# EAGLE design LB_BIT_i20_SOUNDTRIGGER-v03(rev1) (EAGLE 6.6.0)
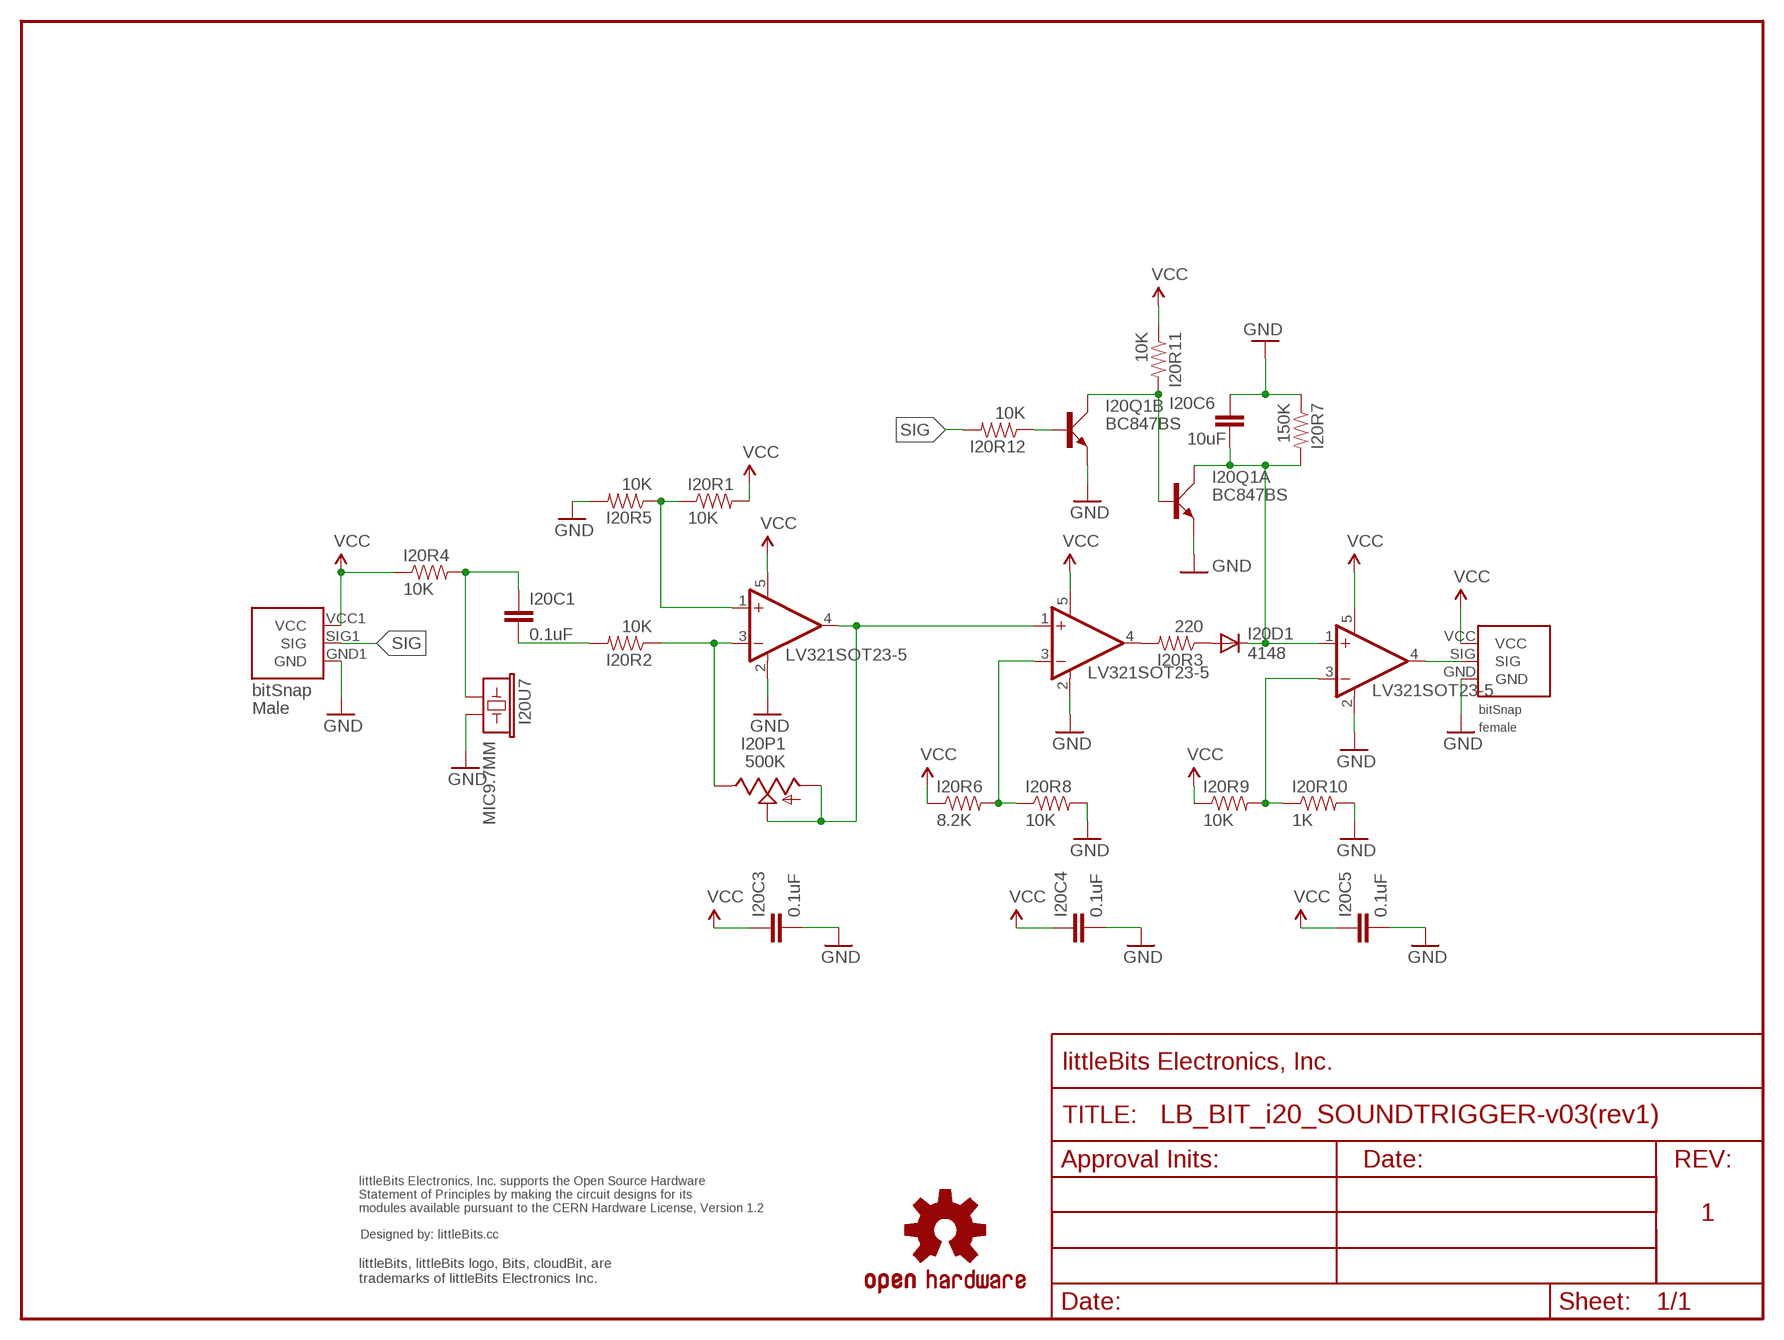
[diagram p0: schematic, sheet 1]

## Parts
I20BSF1  BITSNAP_V03_FEMALE  [BITSNAP_V03_FEMALE]
I20BSM1  BITSNAP_V03_MALE  [BITSNAP_V03_MALE]
I20C1  0.1uF  CAP0603-CAP  [0603-CAP]
I20C3  0.1uF  CAP0603-CAP  [0603-CAP]
I20C4  0.1uF  CAP0603-CAP  [0603-CAP]
I20C5  0.1uF  CAP0603-CAP  [0603-CAP]
I20C6  10uF  CAP0805  [0805]
I20D1  4148  DIODESOD  [SOD-323]
I20P1  500K  POT-TRIM-SMD-BOURNS-3303  [POT-TRIM-SMD-BOURNS-3303]
I20Q1  BC847BS  [SOT363_PHILIPS]
I20R1  10K  RESISTOR0603-RES  [0603-RES]
I20R2  10K  RESISTOR0603-RES  [0603-RES]
I20R3  220  RESISTOR0603-RES  [0603-RES]
I20R4  10K  RESISTOR0603-RES  [0603-RES]
I20R5  10K  RESISTOR0603-RES  [0603-RES]
I20R6  8.2K  RESISTOR0603-RES  [0603-RES]
I20R7  150K  RESISTOR0603-RES  [0603-RES]
I20R8  10K  RESISTOR0603-RES  [0603-RES]
I20R9  10K  RESISTOR0603-RES  [0603-RES]
I20R10  1K  RESISTOR0603-RES  [0603-RES]
I20R11  10K  RESISTOR0603-RES  [0603-RES]
I20R12  10K  RESISTOR0603-RES  [0603-RES]
I20U1  LV321SOT23-5  [SOT23-5]
I20U2  LV321SOT23-5  [SOT23-5]
I20U3  LV321SOT23-5  [SOT23-5]
I20U7  MIC9.7MM  [MIC-9.7MM]
U$1  OSHWCREDIT  [OSHWCREDIT]
U$5  FRAME-LETTER-OHWOHW  [FABDWG01-OHW]
U$29  OSHW-LOGOL  [OSHW-LOGO-L]

## Nets
GND: I20BSF1.GND I20BSM1.GND1(GND) I20C3.2 I20C4.2 I20C5.2 I20C6.1 I20Q1.1(A:E) I20Q1.4(B:E) I20R5.2 I20R7.1 I20R8.2 I20R10.2 I20U1.2(V-) I20U2.2(V-) I20U3.2(V-) I20U7.2
N$1: I20P1.3(E) I20R2.1 I20U1.3(-IN)
N$2: I20C1.2 I20R2.2
N$3: I20C1.1 I20R4.2 I20U7.1
N$4: I20P1.1(A) I20P1.2(S) I20U1.4(OUT) I20U2.1(+IN)
N$5: I20R1.1 I20R5.1 I20U1.1(+IN)
N$6: I20C6.2 I20D1.1(C) I20Q1.6(A:C) I20R7.2 I20U3.1(+IN)
N$7: I20R6.2 I20R8.1 I20U2.3(-IN)
N$8: I20R3.2 I20U2.4(OUT)
N$9: I20Q1.2(A:B) I20Q1.3(B:C) I20R11.2
N$10: I20BSF1.SIG I20U3.4(OUT)
N$11: I20R9.2 I20R10.1 I20U3.3(-IN)
N$12: I20D1.2(A) I20R3.1
N$14: I20Q1.5(B:B) I20R12.1
SIG: I20BSM1.SIG1(SIG) I20R12.2
VCC: I20BSF1.VCC I20BSM1.VCC1(VCC) I20C3.1 I20C4.1 I20C5.1 I20R1.2 I20R4.1 I20R6.1 I20R9.1 I20R11.1 I20U1.5(V+) I20U2.5(V+) I20U3.5(V+)

## Notes on the sheet
- 1

## Library data of the parts
I20BSF1 = bitSnap:BITSNAP_V03_FEMALE
I20BSM1 = bitSnap:BITSNAP_V03_MALE
I20C1 I20C3-I20C6 = SparkFun:CAP: Capacitor Standard 0603 ceramic capacitor, and 0.1" leaded capacitor.
I20D1 = SparkFun:DIODE: Diode These are standard reverse protection diodes and small signal diodes. SMA package can handle up to about 1A. SOD-323 can handle about 200mA. What the SOD-323 package when ordering, there are some mfgs out there that are 5-pin packages.
I20P1 = LITTLEBITS:POT-TRIM-SMD-BOURNS-3303
I20Q1 = transistor-small-signal:BC847BS: NPN general purpose double transistor Source: http://www.farnell.com/datasheets/2466.pdf
I20R1-I20R12 = SparkFun:RESISTOR: Resistor Basic schematic elements and footprints for 0603, 1206, and PTH resistors.
I20U1-I20U3 = LITTLEBITS:LV321
I20U7 = SparkFun:MIC: Microphone Omni-directional electret microphone. 9.7mm standard diameter.
U$1 = LITTLEBITS:OSHWCREDIT
U$5 = LITTLEBITS:FRAME-LETTER-OHW
U$29 = SparkFun_NEW:OSHW-LOGO: Open Source Hardware Logo This logo indicates the piece of hardware it is found on incorporates a OSHW license and/or adheres to the definition of open source hardware found here: http://freedomdefined.org/OSHW

## Board
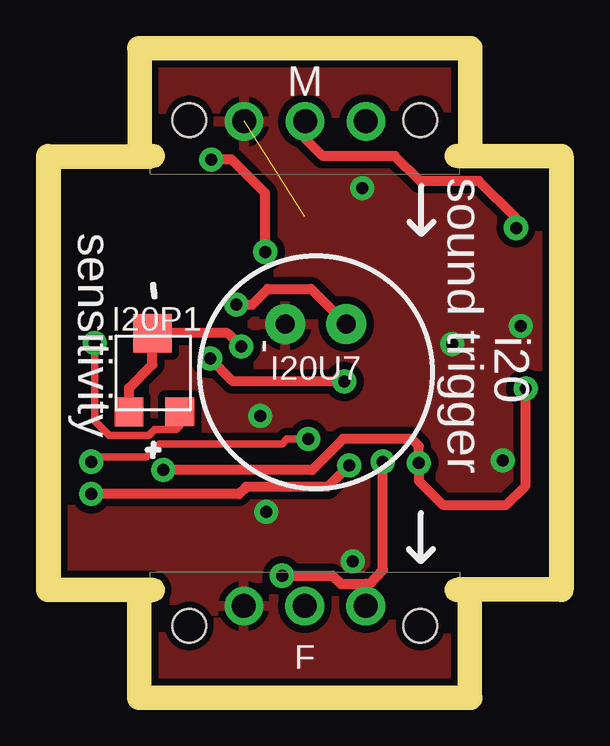
[diagram p1: board, top side]
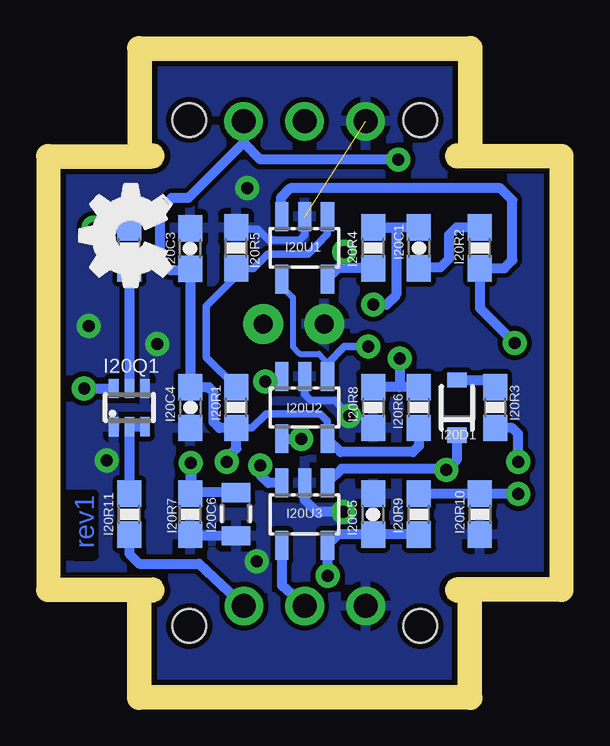
[diagram p2: board, bottom side, seen from below]

Size 20.4 x 26.1 mm. Coordinates in mm from the lower left corner, seen from the top.
Outline: 0,21.6 0,4.5
Outline: 20.4,4.5 20.4,21.6
Copper layers (1*16): Top 0.035mm / dielectric 1.5mm / Bottom 0.035mm
Design rules "default": minimum track width 8mil, minimum drill 0.5mm, track to track 8mil, track to pad 8mil, pad to pad 8mil, via to via 8mil, smd to smd 8mil, copper to edge 10mil, drill to drill 8mil, minimum pad ring 12mil, minimum via ring 10mil, stop-mask expansion 4mil, vias tented up to drill 25mil, thermal gap 10mil
Milling: 2 lines

### Footprints (pad centres in the part's own frame; a part is rotated, then mirrored left to right if it is on the bottom)
BITSNAP_V03_FEMALE = drill 1: GND 3.91,3.33; SIG 6.45,3.33; VCC 8.99,3.33 | hole 1.4: 1.63,2.5; 11.27,2.5
BITSNAP_V03_MALE = drill 1: GND1 8.98,2.56; SIG1 6.44,2.56; VCC1 3.9,2.56 | hole 1.4: 11.27,2.5; 1.63,2.5
0603-CAP = smd 1.1 x 1: 1 -0.85,0; 2 0.85,0
0805 = smd 0.8 x 1.2: 1 -0.9,0; 2 0.9,0
SOD-323 = smd 0.63 x 0.83: 1 -1.15,0; 2 1.15,0
POT-TRIM-SMD-BOURNS-3303 = smd 1.2 x 1.2: 1 0.543,-3.172; 3 2.66,-3.168 | smd 1.6 x 1.6: 2 1.52,0.115
SOT363_PHILIPS = smd 0.4 x 0.8: 1 -0.65,-0.8; 2 0,-0.8; 3 0.65,-0.8; 4 0.65,0.8; 5 0,0.8; 6 -0.65,0.8
0603-RES = smd 1.1 x 1: 1 -0.85,0; 2 0.85,0
SOT23-5 = smd 0.55 x 1.2: 1 -0.95,-1.3; 2 0,-1.3; 3 0.95,-1.3; 4 0.95,1.3; 5 -0.95,1.3
MIC-9.7MM = drill 0.8 pad 1.676: 1 -2,1.27; 2 -2,-1.27

### Placement (x,y rotation side)
I20BSF1  3.75,0 0 top
I20BSM1  16.65,26.1 180 top
I20C1  5.45,18.27 270 bottom
I20C3  14.98,18.23 90 bottom
I20C4  14.97,11.61 270 bottom
I20C5  7.35,7.16 90 bottom
I20C6  13.06,7.16 90 bottom
I20D1  3.86,11.61 90 bottom
I20P1  2.33,14.6 0 top
I20Q1  17.51,11.61 0 bottom
I20R1  13.06,11.61 270 bottom
I20R2  2.9,18.27 90 bottom
I20R3  2.27,11.61 270 bottom
I20R4  7.35,18.27 90 bottom
I20R5  13.06,18.27 90 bottom
I20R6  5.45,11.61 90 bottom
I20R7  14.97,7.16 90 bottom
I20R8  7.35,11.61 270 bottom
I20R9  5.45,7.16 90 bottom
I20R10  2.9,7.16 270 bottom
I20R11  17.51,7.16 90 bottom
I20R12  17.51,18.27 90 bottom
I20U1  10.21,18.27 180 bottom
I20U2  10.21,11.61 180 bottom
I20U3  10.21,7.16 180 bottom
I20U7  10.66,13.09 270 top
U$1  -93.4,-62.15 0 top  (outside the outline)
U$2  [OSHW_FILLX150_NOTEXT]  15.77,15.82 0 top
U$3  [+]  3.5,9.45 0 top
U$4  [-]  3.7,16.9 270 top
U$5  0,0 0 top
U$29  -34.95,-67.36 0 top  (outside the outline)

### Tracks (layer width: path | path; a pad name or v marks a point on that pad's centre or on a via)
GND  (via drill 0.5)  (1 unrouted)
  Top 0.305: 8.3,11.3 v8.35,11.25
  Bottom 0.305: I20U1.2 10.21,18.79 10.4,18.6 11.7,18.6 12.15,19.05 13,19.05 I20R5.2 | I20U2.2 10.21,12.16 9.95,11.9 8.95,11.9 v8.35,11.25
  Bottom 0.406: I20C6.1 14.92,6.26 I20R7.1 | v8.6,7.25 9.7,7.25 10.2,7.75 I20U3.2
  other vias: 12.6,20.75 18.45,9.4 16.35,14.25 12.2,5.2 19.2,15
  pour Top (isolate 0.305): 0.25,25.87 20.17,25.87 20.17,0.25 0.25,0.25
  pour Bottom: 0.25,25.87 20.17,25.87 20.17,0.25 0.25,0.25
N$1  (via drill 0.5)
  Top 0.305: v1.45,14.3 1.45,11.05 2.05,10.45 3.7,10.45 3.95,10.7 4.85,10.7 5,10.85 I20P1.3
  Bottom 0.406: I20U1.3 11.2,19.61 11.2,20.35 10.8,20.75 2.05,20.75 1.55,20.25 1.55,17.75 1.89,17.41 I20R2.1 2.9,15.76 v1.45,14.3
N$2
  Bottom 0.406: I20R2.2 3.88,19.11 4.2,18.8 4.2,17.8 4.55,17.45 5.41,17.45 I20C1.2
N$3  (via drill 0.5)
  Top 0.406: v7.35,15.9 8,15.9 8.65,16.55 10.46,16.55 I20U7.1
  Bottom 0.406: I20C1.1 I20R4.2 6.42,19.11 6.4,19.1 6.4,16.3 6.8,15.9 v7.35,15.9
N$4  (via drill 0.5)
  Top 0.406: v7.55,14.15 6.99,14.71 I20P1.2 3.85,13.4 2.88,12.43 I20P1.1
  Bottom 0.254: I20U1.4 11.16,16.64 10.7,16.2 10.7,14.15 10.4,13.85 9.6,13.85 9.25,13.45
  Bottom 0.305: v7.55,14.15 8.55,14.15 9.25,13.45
  Bottom 0.406: 9.25,13.45 9.25,12.96 I20U2.1
N$5
  Bottom 0.305: I20U1.1 9.26,18.84 10.05,18 11.75,18 12.35,17.4 I20R5.1 | I20R5.1 13.06,17.09 14.3,15.85 14.3,13.69 I20R1.1
  Bottom 0.406: I20R5.1
N$6  (via drill 0.5)
  Top 0.406: v19.4,12.4 19.4,8.35 18.6,7.55 15.95,7.55 14.95,8.55 v14.95,9.3 14.95,10 14.65,10.3 11.8,10.3 10.5,9 v4.3,9
  Bottom 0.406: 14.92,8.06 I20C6.2 14.94,8.06 14.95,8.05 14.95,9.25 | 14.92,8.06 I20R7.2 | 4.04,10.46 I20D1.1 3.85,10.45 3.85,9.45 4.21,9.09 4.36,8.99 | 4.36,8.99 4.4,9.05 8.67,9.05 I20U3.1 | 14.92,8.06 14.92,9.27 v14.95,9.3 | v19.4,12.4 I20Q1.6 | v4.3,9 4.32,9 4.36,8.99
N$7  (via drill 0.5)
  Top 0.406: v11.85,12.7 7.2,12.7 v6.25,13.65
  Bottom 0.406: I20R6.2 6.25,12.46 | 6.25,12.46 I20R8.1 | I20U2.3 11.74,12.71 v11.85,12.7 | v6.25,13.65 6.25,12.46
N$8  (via drill 0.5)
  Top 0.305: v10.35,10.3 9.45,10.3 9.25,10.1 4.15,10.1 3.6,9.55 1.5,9.55 v1.3,9.35
  Bottom 0.406: I20U2.4 10.26,10.3 v10.35,10.3 | v1.3,9.35 1.31,10.3 1.31,10.52 1.55,10.75 I20R3.2
N$9
  Bottom 0.406: I20Q1.3 I20Q1.2 I20R11.2
N$10
  Bottom 0.406: I20U3.4 11.16,4.19 I20BSF1.SIG
N$11  (via drill 0.5)
  Top 0.406: v12.05,9.2 11.15,8.3 7.75,8.3 7.45,8 v1.3,8
  Bottom 0.406: I20R9.2 I20R10.1 v1.3,8 | I20U3.3 11.71,8.46 12.05,8.8 v12.05,9.2
N$12
  Bottom 0.406: I20D1.2 2.57,12.76 I20R3.1
N$14
  Bottom 0.406: I20R12.1 I20Q1.5
SIG  (via drill 0.5)
  Top 0.406: v19,19.1 19,19.5 17.45,21.05 15,21.05 13.95,22.1 10.95,22.1 10.2,22.85 10.2,23.63 I20BSM1.SIG1
  Bottom 0.406: v19,19.1 v19.01,19.09 17.54,19.09 I20R12.2
VCC  (via drill 0.5)
  Top 0.406: v9.25,4.6 11.35,4.6 11.7,4.25 12.9,4.25 | 12.9,4.25 13.45,4.85 v13.45,9.35 | v8.55,18.1 8.55,20.55 7.15,21.95 v6.3,21.95 | I20BSF1.VCC 12.74,4.26 12.9,4.25
  Bottom 0: 8.81,6.31 8.94,6.31 9.25,6 v9.25,4.6
  Bottom 0.305: I20U2.5 9.26,11.06 9.55,11.35 11.8,11.35 12.4,10.75 I20R1.2
  Bottom 0.406: I20BSM1.VCC1 12.75,22.65 | 12.75,22.65 15.05,20.35 15.75,20.35 16.25,19.85 16.25,17.75 15.85,17.35 15.02,17.35 I20C3.1 I20C4.1 14.2,12.45 14,12.25 14,11 13.76,10.76 I20R1.2 | I20R4.1 8.81,17.41 I20U1.5 9.26,16.99 8.55,17.65 v8.55,18.1 | I20R9.1 I20C5.1 8.81,6.31 I20U3.5 v9.26,4.61 v9.25,4.6 | I20R6.1 5.45,10.01 5.7,9.75 8.7,9.75 I20U2.5 | I20R1.2 | v13.45,9.35 13.45,9.5 13.05,9.9 13.05,10.74 I20R1.2 | I20R11.1 17.51,5.51 17.1,5.1 14.61,5.1 I20BSF1.VCC | v6.3,21.95 12.05,21.95 12.75,22.65

### Text on the board
Bottom: rev1
tPlace: sound trigger | sensitivity | i20
tNames: I20P1 | I20U7
Milling: 1mm DIA. ROUTER PATH
Reference: MEDIUM
dxf: 1 | i20 SOUND TRIGGER BIT PCB | LB-BIT-i20-SOUNDTRIGGER-v03-GERBER-rev1 (8-31-2012)